# Altium schematic sheet lab2_kapustin_buck.SchDoc: =title_line_1 + title_line_2
size 594 x 420 mm
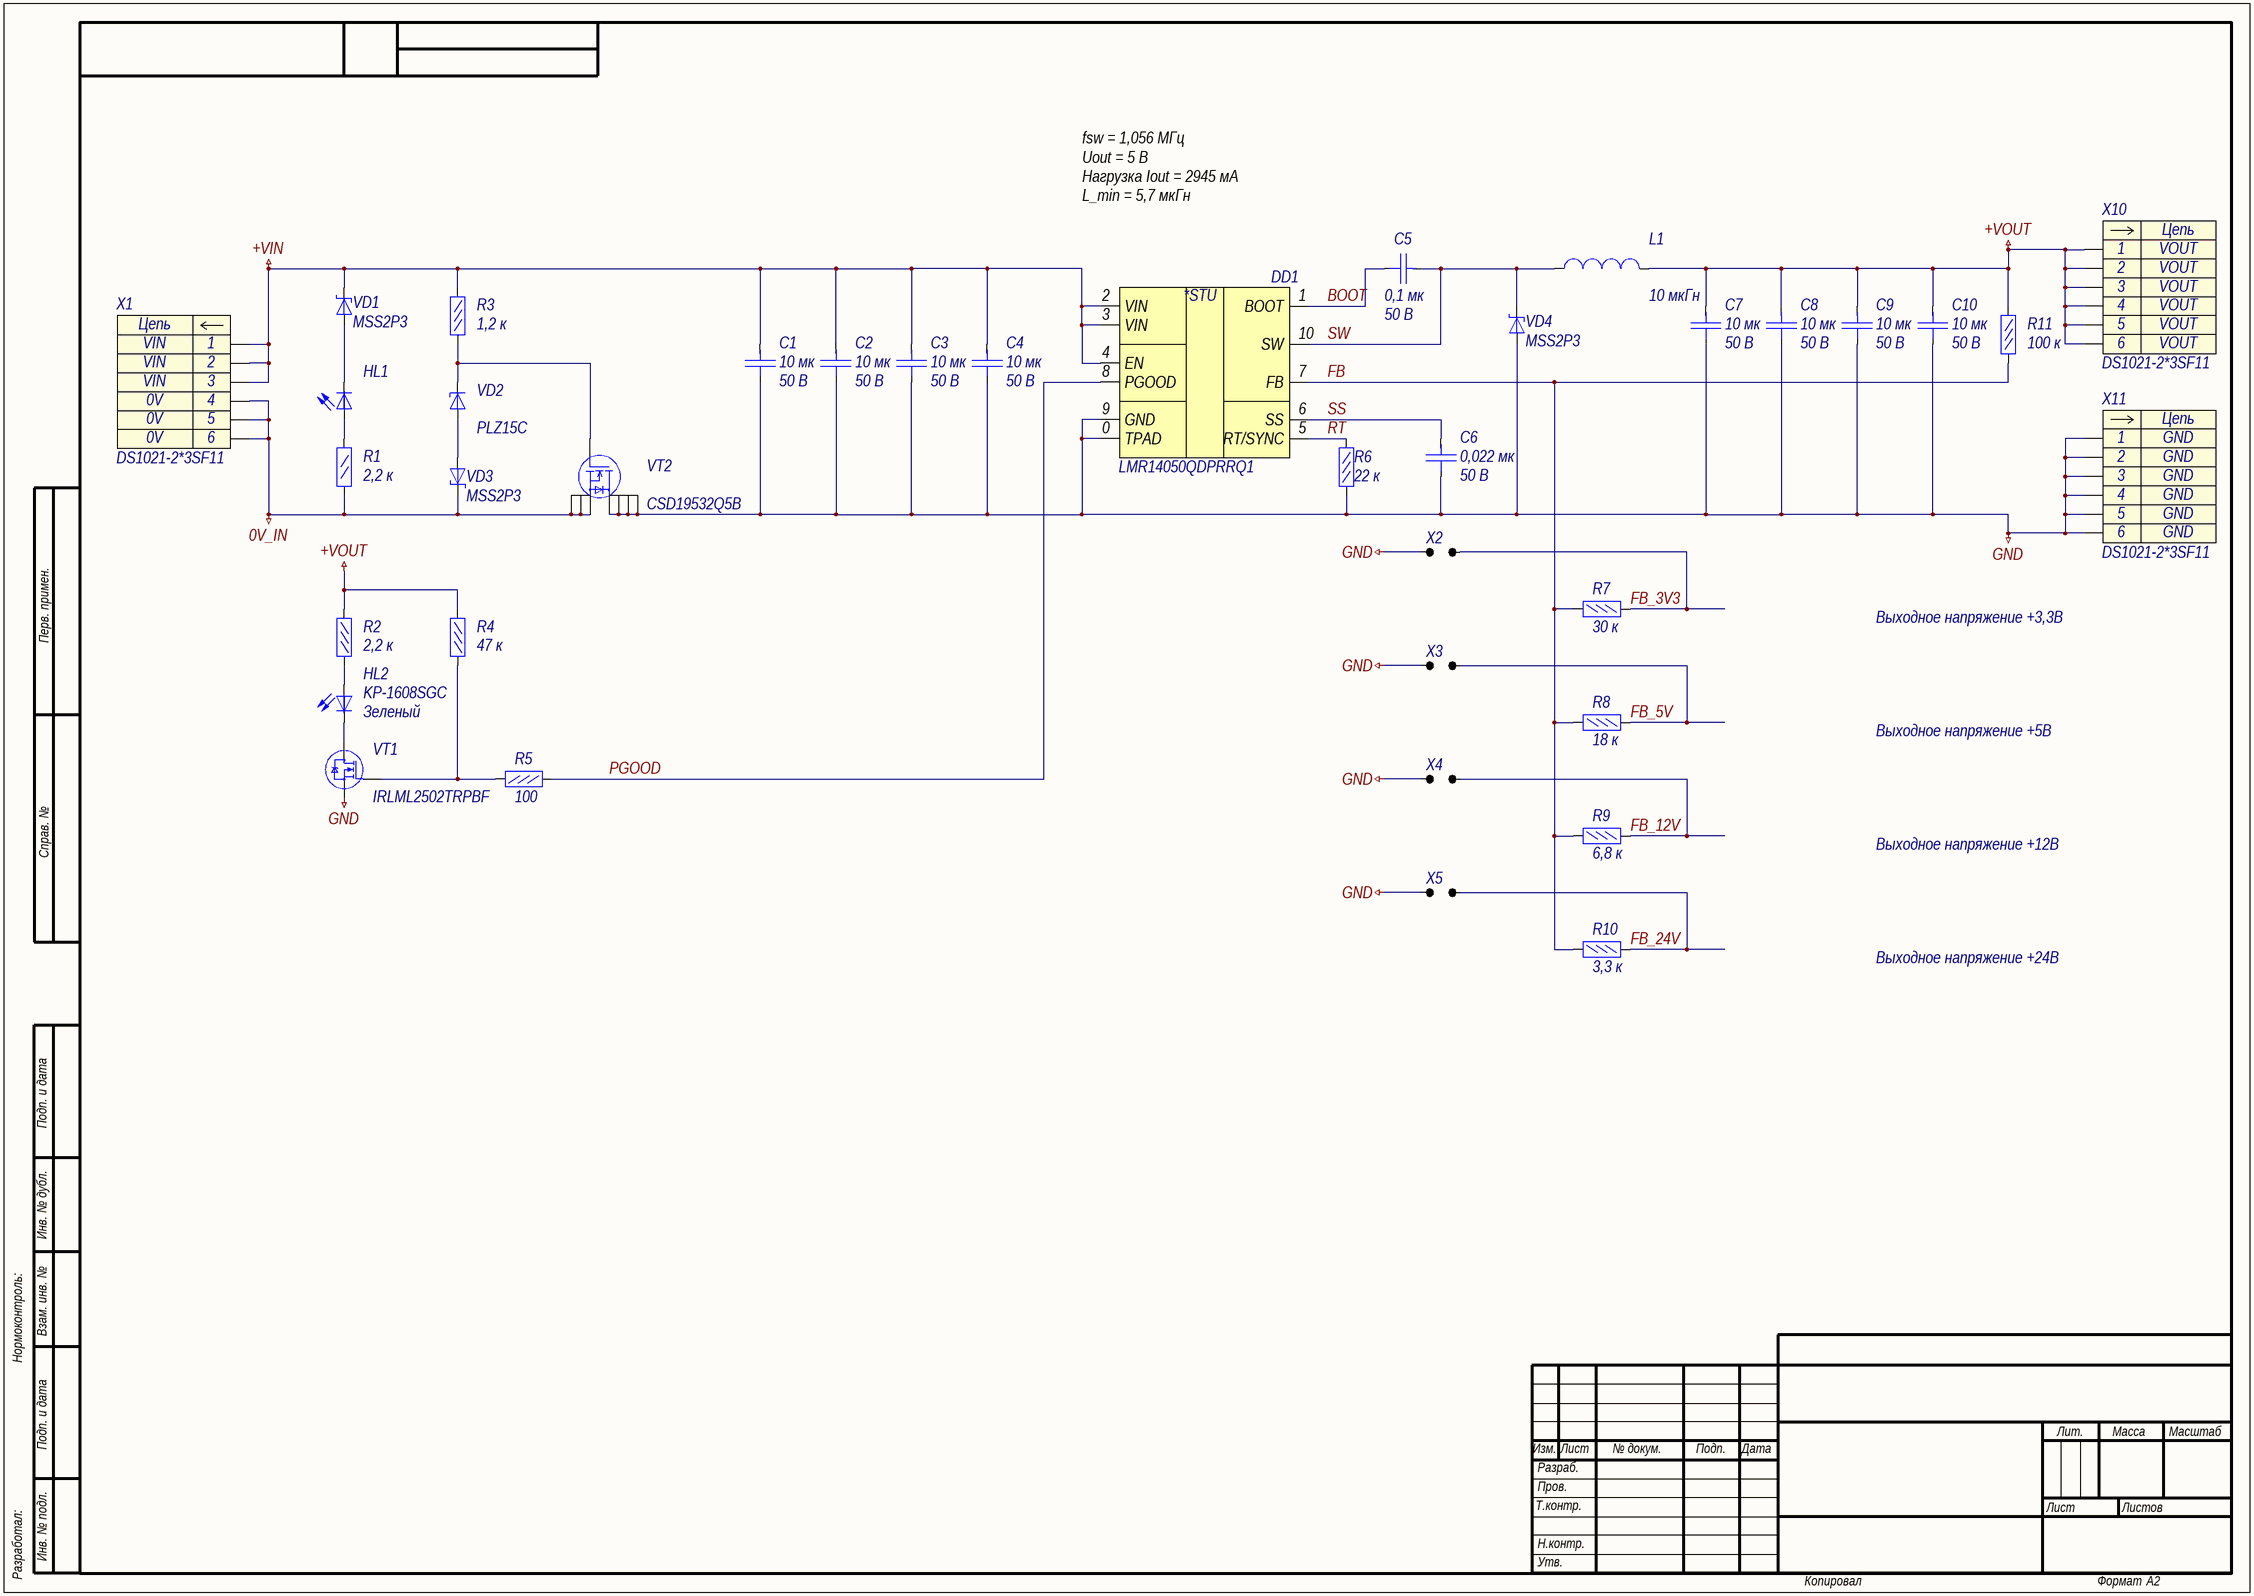
[diagram p0: lab2_kapustin_buck.SchDoc]

## Parts
C1  10 мк  Напряжение: 50 В  [C1206]
C2  10 мк  Напряжение: 50 В  [C1206]
C3  10 мк  Напряжение: 50 В  [C1206]
C4  10 мк  Напряжение: 50 В  [C1206]
C5  0,1 мк  Напряжение: 50 В  [C0603]
C6  0,022 мк  Напряжение: 50 В  [C0603]
C7  10 мк  Напряжение: 50 В  [C1206]
C8  10 мк  Напряжение: 50 В  [C1206]
C9  10 мк  Напряжение: 50 В  [C1206]
C10  10 мк  Напряжение: 50 В  [C1206]
DD1  LMR14050QDPRRQ1  [WSON-10]
HL1  KP-1608EC  [D0603]  (value not drawn)
HL2  Цвет: Зеленый  [D0603]  (hidden comment: KP-1608SGC)
L1  10 мкГн  [IHLP2525CZ]
R1  2,2 к  [R0805]
R2  2,2 к  [R0603]
R3  1,2 к  [R0603]
R4  47 к  [R0603]
R5  100  [R0603]
R6  22 к  [R0603]
R7  30 к  [R0603]
R8  18 к  [R0603]
R9  6,8 к  [R0603]
R10  3,3 к  [R0603]
R11  100 к  [R0603]
VD1  MSS2P3  [DO-219AD]
VD2  PLZ15C  [DO-219AC]
VD3  MSS2P3  [DO-219AD]
VD4  MSS2P3  [DO-219AD]
VT1  IRLML2502TRPBF  [SOT23-3]
VT2  CSD19532Q5B  [SON-8P]
X1  DS1021-2*3SF11  [PLS-2,54-2X3-THT-V]
X2  Перемычка запаиваемая 3x1  [JUMPER_SOLDERED_3X1]  (value not drawn)  (no BOM)
X3  Перемычка запаиваемая 3x1  [JUMPER_SOLDERED_3X1]  (value not drawn)  (no BOM)
X4  Перемычка запаиваемая 3x1  [JUMPER_SOLDERED_3X1]  (value not drawn)  (no BOM)
X5  Перемычка запаиваемая 3x1  [JUMPER_SOLDERED_3X1]  (value not drawn)  (no BOM)
X10  DS1021-2*3SF11  [PLS-2,54-2X3-THT-V]
X11  DS1021-2*3SF11  [PLS-2,54-2X3-THT-V]

## Nets
0V_IN: R1.1 VD3.2(K) VT2.S X1.4 X1.5 X1.6
+VIN: C1.2 C2.2 C3.2 C4.2 DD1.2(VIN) DD1.3(VIN) DD1.4(EN) R3.2 VD1.2(K) X1.1 X1.2 X1.3
+VOUT: C7.2 C8.2 C9.2 C10.2 L1.2 R2.2 R4.2 R11.2 X10.1 X10.2 X10.3 X10.4 X10.5 X10.6
GND: C1.1 C2.1 C3.1 C4.1 C6.1 C7.1 C8.1 C9.1 C10.1 DD1.0(TPAD) DD1.9(GND) R6.2 VD4.1(A) VT1.2(S) VT2.D X2.1 X3.1 X4.1 X5.1 X11.1 X11.2 X11.3 X11.4 X11.5 X11.6
BOOT: C5.1 DD1.1(BOOT)
FB: DD1.7(FB) R7.1 R8.2 R9.1 R10.1 R11.1
FB_3V3: R7.2 X2.2
FB_5V: R8.1 X3.2
FB_12V: R9.2 X4.2
FB_24V: R10.2 X5.2
PGOOD: DD1.8(PGOOD) R5.1
RT: DD1.5(RT/SYNC) R6.1
SS: C6.2 DD1.6(SS)
SW: C5.2 DD1.10(SW) L1.1 VD4.2(K)
NetHL1_1: HL1.1(A) R1.2
NetHL1_2: HL1.2(K) VD1.1(A)
NetHL2_1: HL2.1(A) R2.1
NetHL2_2: HL2.2(K) VT1.3(D)
NetR3_1: R3.1 VD2.2(K) VT2.G
NetR4_1: R4.1 R5.2 VT1.1(G)
NetVD2_1: VD2.1(A) VD3.1(A)

## Notes on the sheet
- fsw = 1,056 МГц
  Uout = 5 В
  Нагрузка Iout = 2945 мА
  L_min = 5,7 мкГн
- Выходное напряжение +3,3В
- Выходное напряжение +5В
- Выходное напряжение +12В
- Выходное напряжение +24В
- Перв. примен.
- Справ. №
- Подп. и дата
- Инв. № дубл.
- Нормоконтроль:
- Взам. инв. №
- Изм.
- Лист
- № докум.
- Подп.
- Дата
- Лит.
- Масса
- Масштаб
- Т.контр.
- Пров.
- Разраб.
- Листов
- Разработал:
- Инв. № подл.
- Н.контр.
- Утв.
- Копировал
- Формат
- А2
- (in symbol cn0076) Цепь
- (in symbol dcdc0002) *STU

## Library data of the parts
C1 C2 C7-C10 = с0042: Конденсатор; id: с0042; Фамилия: Капустин; Описание: Конденсатор керамический 1206 10 мкФ 50 В ±10 % X7R; Наименование: CL31B106KBHNNN; Производитель: Samsung; Корпус: 1206; Отклонение: ±10 %; ТКЕ: X7R; Примечание: В наименовании убрана последняя буква, обозначающая упаковку; ClassName: *; Номинал: 10 мк; HelpURL: http://weblib.samsungsem.com/mlcc/mlcc-ec-data-sheet.do?partNumber=CL31B106KBHNNN
C3 C4 = c0004: Конденсатор; id: c0004; Фамилия: Капустин; Описание: Конденсатор керамический 1206 10 мкФ 50 В ±10 % X5R; Наименование: CL31A106KBHNNNE; Производитель: Samsung; Корпус: 1206; Отклонение: ±10 %; ТКЕ: X5R; Номинал: 10 мк; HelpURL: http://www.samsungsem.com/kr/support/product-search/mlcc/__icsFiles/afieldfile/2019/05/10/19-CL31A106KBHNNNE.pdf; ClassName: POWER; Parameter 1: *
C5 = c0007: Конденсатор; id: c0007; Фамилия: Черемный; Описание: Конденсатор керамический 0603 0,1 мкФ 50 В ±10 % X7R; Наименование: CL10B104KB8NNN; Производитель: Samsung; Корпус: 0603; Отклонение: ±10 %; ТКЕ: X7R; Примечание: В наименовании убрана последняя буква, обозначающая упаковку; Номинал: 0,1 мк; HelpURL: http://www.samsungsem.com/kr/support/product-search/mlcc/__icsFiles/afieldfile/2019/06/18/CL10B104KB8NNNC-19.pdf; ClassName: POWER
C6 = c0030: Конденсатор; id: c0030; Фамилия: Капустин; Описание: Конденсатор керамический 0603 0,022 мкФ 50 В ±10 % X7R; Наименование: CL10B223KB8NNN; Производитель: Samsung; Корпус: 0603; Отклонение: ±10 %; ТКЕ: X7R; Примечание: В наименовании убрана последняя буква, обозначающая упаковку; Номинал: 0,022 мк; HelpURL: http://www.samsungsem.com/kr/support/product-search/mlcc/__icsFiles/afieldfile/2019/06/18/CL10B223KB8NNND-19.pdf; ClassName: POWER
DD1 = dcdc0002: Фамилия: Капустин; Описание: Понижающий импульсный стабилизатор; Напряжение питания ном#: 24 В; Входное напряжение мин#: 4 В; Входное напряжение макс#: 40 В; Выходное напряжение, мин#: 0,8 В; Выходное напряжение, макс#: 28 В; Выходной ток: 5 А; Частота коммутации: 0,2 … 2,5 МГц; Производитель: Texas Instruments; Температура окружающей среды (корпуса), мин#: -40 °C; Температура окружающей среды (корпуса), макс#: +125 °C; id: dcdc0002; Наименование: LMR14050QDPRRQ1; Корпус: WSON-10; HelpURL: http://www.ti.com/lit/ds/symlink/lmr14050-q1.pdf; ClassName: POWER
HL1 = led0002: Фамилия: Капустин; Описание: Светодиод красный SMD 0603; Производитель: Kingbright; Цвет: Красный; Максимальное обратное напряжение: 5 В; Прямой ток: 20 мА; Максимальное прямое напряжение: 2,5 В; Максимальный обратный ток: 10 мкА; Максимальный импульсный прямой ток: 160 мА; Температура окружающей среды (корпуса), мин#: -40 °C; Температура окружающей среды (корпуса), макс#: +85 °C; Примечание: Не найти документацию на свйте производителя; ClassName: *; id: led0002; Наименование: KP-1608EC; Корпус: D0603; HelpURL: http://www.farnell.com/datasheets/2045829.pdf?_ga=2.151514041.1066726363.1573580702-223521920.1573064505
HL2 = led0004: Фамилия: Капустин; Описание: Светодиод зеленый SMD 0603; Производитель: Kingbright; Максимальное обратное напряжение: 5 В; Прямой ток: 20 мА; Максимальное прямое напряжение: 2,5 В; Максимальный обратный ток: 11 мкА; Максимальный импульсный прямой ток: 140 мА; Температура окружающей среды (корпуса), мин#: -40 °C; Температура окружающей среды (корпуса), макс#: +85 °C; Примечание: Не найти документацию на свйте производителя; id: led0004; Наименование: KP-1608SGC; Корпус: D0603; HelpURL: http://www.farnell.com/datasheets/2045827.pdf?_ga=2.72147859.1066726363.1573580702-223521920.1573064505; ClassName: POWER
L1 = ind0005: Фамилия: Капустин; Описание: Катушка индуктивности экранированная / 10 мкГн 3 А; Наименование: IHLP2525CZER100M01; Производитель: Vishay; Отклонение: ±20%; Сопротивление обмотки: 102 мОм; Максимальный ток: 4,1 А; Ток насыщения: 7 А; Добротность: 40; Температура окружающей среды (корпуса), мин#: -55 °C; Температура окружающей среды (корпуса), макс#: +125 °C; Корпус: 6,47*6,47*3,0; id: ind0005; Номинал: 10 мкГн; HelpURL: https://www.vishay.com/docs/34104/ihlp-2525cz-01.pdf; ClassName: POWER
R1 = r0378: Резистор 0,125Вт; id: r0378; Фамилия: Капустин; Описание: Резистор чип 0805 2,2 кОм 0,125 Вт ±1 %; Наименование: RC0805FR-072K2L; Производитель: YAGEO; Отклонение: ±1 %; Напряжение: 150 В; Температурный коэффициент сопротивления: 200 ppm; Температура окружающей среды (корпуса), мин#: -55 °C; Температура окружающей среды (корпуса), макс#: +155 °C; Корпус: 0805; ClassName: *; Номинал: 2,2 к; HelpURL: https://www.yageo.com/upload/media/product/products/datasheet/rchip/PYu-RC_Group_51_RoHS_L_10.pdf
R2 = r0253: Резистор 0,063Вт; id: r0253; Фамилия: Капустин; Описание: Резистор чип 0603 2,2 кОм 0,1 Вт ±1 %; Наименование: RC0603FR-072K2L; Производитель: YAGEO; Отклонение: ±1 %; Напряжение: 75 В; Температурный коэффициент сопротивления: 200 ppm; Температура окружающей среды (корпуса), мин#: -55 °C; Температура окружающей среды (корпуса), макс#: +155 °C; Корпус: 0603; Номинал: 2,2 к; HelpURL: https://www.yageo.com/upload/media/product/products/datasheet/rchip/PYu-RC_Group_51_RoHS_L_10.pdf; ClassName: POWER
R3 = r0247: Резистор 0,063Вт; id: r0247; Фамилия: Капустин; Описание: Резистор чип 0603 1,2 кОм 0,1 Вт ±1 %; Наименование: RC0603FR-071K2L; Производитель: YAGEO; Отклонение: ±1 %; Напряжение: 75 В; Температурный коэффициент сопротивления: 200 ppm; Температура окружающей среды (корпуса), мин#: -55 °C; Температура окружающей среды (корпуса), макс#: +155 °C; Корпус: 0603; ClassName: *; Номинал: 1,2 к; HelpURL: https://www.yageo.com/upload/media/product/products/datasheet/rchip/PYu-RC_Group_51_RoHS_L_10.pdf
R4 = r0007: Резистор 0,063Вт; id: r0007; Фамилия: Капустин; Описание: Резистор чип 0603 47 кОм 0,1 Вт ±1 %; Наименование: RC0603FR-0747KL; Производитель: YAGEO; Отклонение: ±1 %; Напряжение: 75 В; Температурный коэффициент сопротивления: 200 ppm; Температура окружающей среды (корпуса), мин#: -55 °C; Температура окружающей среды (корпуса), макс#: +155 °C; Корпус: 0603; Номинал: 47 к; HelpURL: https://www.yageo.com/upload/media/product/products/datasheet/rchip/PYu-RC_Group_51_RoHS_L_10.pdf; ClassName: POWER
R5 = r0005: Резистор 0,063Вт; id: r0005; Фамилия: Капустин; Описание: Резистор чип 0603 100 Ом 0,1 Вт ±1 %; Наименование: RC0603FR-07100RL; Производитель: YAGEO; Отклонение: ±1 %; Напряжение: 75 В; Температурный коэффициент сопротивления: 200 ppm; Температура окружающей среды (корпуса), мин#: -55 °C; Температура окружающей среды (корпуса), макс#: +155 °C; Корпус: 0603; Номинал: 100; HelpURL: https://www.yageo.com/upload/media/product/products/datasheet/rchip/PYu-RC_Group_51_RoHS_L_10.pdf; ClassName: POWER
R6 = r0272: Резистор 0,063Вт; id: r0272; Фамилия: Капустин; Описание: Резистор чип 0603 22 кОм 0,1 Вт ±1 %; Наименование: RC0603FR-0722KL; Производитель: YAGEO; Отклонение: ±1 %; Напряжение: 75 В; Температурный коэффициент сопротивления: 200 ppm; Температура окружающей среды (корпуса), мин#: -55 °C; Температура окружающей среды (корпуса), макс#: +155 °C; Корпус: 0603; ClassName: POWER; Номинал: 22 к; HelpURL: https://www.yageo.com/upload/media/product/products/datasheet/rchip/PYu-RC_Group_51_RoHS_L_10.pdf
R7 = r0020: Резистор 0,063Вт; id: r0020; Фамилия: Капустин; Описание: Резистор чип 0603 30 кОм 0,1 Вт ±1 %; Наименование: RC0603FR-0730KL; Производитель: YAGEO; Отклонение: ±1 %; Напряжение: 75 В; Температурный коэффициент сопротивления: 100 ppm; Температура окружающей среды (корпуса), мин#: -55 °C; Температура окружающей среды (корпуса), макс#: +155 °C; Корпус: 0603; ClassName: *; Номинал: 30 к; HelpURL: https://www.yageo.com/upload/media/product/products/datasheet/rchip/PYu-RC_Group_51_RoHS_L_10.pdf
R8 = r0002: Резистор 0,063Вт; id: r0002; Фамилия: Капустин; Наименование: RC0603FR-0718KL; Производитель: YAGEO; Отклонение: ±1 %; Напряжение: 75 В; Корпус: 0603; Температурный коэффициент сопротивления: 200 ppm; Температура окружающей среды (корпуса), мин#: -55 °C; Температура окружающей среды (корпуса), макс#: +155 °C; Описание: Резистор чип 0603 18 кОм 0,1 Вт ±1 %; Номинал: 18 к; HelpURL: https://www.yageo.com/upload/media/product/products/datasheet/rchip/PYu-RC_Group_51_RoHS_L_10.pdf; ClassName: POWER
R9 = r0264: Резистор 0,063Вт; id: r0264; Фамилия: Капустин; Описание: Резистор чип 0603 6,8 кОм 0,1 Вт ±1 %; Наименование: RC0603FR-076K8L; Производитель: YAGEO; Отклонение: ±1 %; Напряжение: 75 В; Температурный коэффициент сопротивления: 200 ppm; Температура окружающей среды (корпуса), мин#: -55 °C; Температура окружающей среды (корпуса), макс#: +155 °C; Корпус: 0603; ClassName: *; Номинал: 6,8 к; HelpURL: https://www.yageo.com/upload/media/product/products/datasheet/rchip/PYu-RC_Group_51_RoHS_L_10.pdf
R10 = r0257: Резистор 0,063Вт; id: r0257; Фамилия: Капустин; Описание: Резистор чип 0603 3,3 кОм 0,1 Вт ±1 %; Наименование: RC0603FR-073K3L; Производитель: YAGEO; Отклонение: ±1 %; Напряжение: 75 В; Температурный коэффициент сопротивления: 200 ppm; Температура окружающей среды (корпуса), мин#: -55 °C; Температура окружающей среды (корпуса), макс#: +155 °C; Корпус: 0603; ClassName: *; Номинал: 3,3 к; HelpURL: https://www.yageo.com/upload/media/product/products/datasheet/rchip/PYu-RC_Group_51_RoHS_L_10.pdf
R11 = r0016: Резистор 0,063Вт; id: r0016; Фамилия: Капустин; Описание: Резистор чип 0603 100 кОм 0,1 Вт ±1 %; Наименование: RC0603FR-07100KL; Производитель: YAGEO; Отклонение: ±1 %; Напряжение: 75 В; Температурный коэффициент сопротивления: 200 ppm; Температура окружающей среды (корпуса), мин#: -55 °C; Температура окружающей среды (корпуса), макс#: +155 °C; Корпус: 0603; Номинал: 100 к; HelpURL: https://www.yageo.com/upload/media/product/products/datasheet/rchip/PYu-RC_Group_51_RoHS_L_10.pdf; ClassName: POWER
VD1 VD3 VD4 = vd0002: id: vd0002; Фамилия: Капустин; Описание: Диод Шоттки 30 В 2 А; Производитель: Vishay; Максимальное обратное напряжение: 30 В; Максимальный прямой ток: 2 А; Максимальное прямое напряжение: 0,6 В; Максимальный обратный ток: 250 мкА; Максимальный импульсный прямой ток: 30 А; Температура окружающей среды (корпуса), мин#: -55 °C; Температура окружающей среды (корпуса), макс#: +150 °C; ClassName: POWER; Наименование: MSS2P3; Корпус: DO-219AD; HelpURL: https://www.vishay.com/docs/89054/mss2p3.pdf
VD2 = vd0010: id: vd0010; Фамилия: Черемный; Описание: Стабилитрон 15В; Производитель: Vishay; Максимальное обратное напряжение: 15 В; Температура окружающей среды (корпуса), мин#: -40 °C; Температура окружающей среды (корпуса), макс#: 150 °C; ClassName: *; Наименование: PLZ15C; Корпус: DO-219AC; HelpURL: https://www.vishay.com/docs/84830/plzseries.pdf
VT1 = mos0001: Фамилия: Капустин; Описание: Транзистор полевой N-канальный 20 В 4,2 А; Производитель: International Rectifier; Сопротивление сток-исток: 0,045 Ом; Напряжение затвор-исток: ±12 В; Напряжение сток-исток: 20 В; Ток стока: 4,2 А; Температура окружающей среды (корпуса), мин#: -55 °C; Температура окружающей среды (корпуса), макс#: +150 °C; id: mos0001; Наименование: IRLML2502TRPBF; Корпус: SOT23-3; HelpURL: https://www.infineon.com/dgdl/irlml2502pbf.pdf?fileId=5546d462533600a401535668048e2606; ClassName: POWER
VT2 = mos0003: Фамилия: Капустин; Описание: Транзистор полевой N-канальный 100 В 17 А; Производитель: Texas Instruments; Сопротивление сток-исток: 0,0057 Ом; Напряжение затвор-исток: ±20 В; Напряжение сток-исток: 100 В; Ток стока: 17 А; Температура окружающей среды (корпуса), мин#: -55 °C; Температура окружающей среды (корпуса), макс#: +150 °C; Корпус: SON8P (5x6 мм); id: mos0003; Наименование: CSD19532Q5B; HelpURL: http://www.ti.com/lit/ds/symlink/csd19532q5b.pdf
X1 = cn0076: Contact_01: VIN; Contact_04: 0V; id: cn0076; Фамилия: Капустин; Описание: PLS 6-ти контактный прямой двухрядный (2,54 мм); Производитель: Connfly Electronic Co. LTD; Количество контактов: 6; Цвет: Черный; Ток на контакт: 3 А; Напряжение: 250 В; Шаг: 2,54 мм; Семейство: PLS; Тип вывода: Прямой; Температура окружающей среды (корпуса), мин#: -40 °C; Температура окружающей среды (корпуса), макс#: +105 °C; Альтернатива: не указана; Ответная часть: DS1023-2*3S22; Контакт: отсутствует; Contact_02: VIN; Contact_03: VIN; Contact_05: 0V; Contact_06: 0V; ClassName: *; Наименование: DS1021-2*3SF11; HelpURL: http://www.connfly.com/userfiles/image/UpLoadFile/File/2015/1/29/DS1021.pdf
X2-X5 = fstn0012: Диаметр отверстия: отсутствует; Параметры металлизации: 3x1 мм; id: fstn0012; Описание: Перемычка запаиваемая; Наименование: Перемычка запаиваемая 3x1
X10 = cn0076: Contact_01: VOUT; id: cn0076; Фамилия: Капустин; Описание: PLS 6-ти контактный прямой двухрядный (2,54 мм); Производитель: Connfly Electronic Co. LTD; Количество контактов: 6; Цвет: Черный; Ток на контакт: 3 А; Напряжение: 250 В; Шаг: 2,54 мм; Семейство: PLS; Тип вывода: Прямой; Температура окружающей среды (корпуса), мин#: -40 °C; Температура окружающей среды (корпуса), макс#: +105 °C; Альтернатива: не указана; Ответная часть: DS1023-2*3S22; Контакт: отсутствует; Contact_02: VOUT; Contact_03: VOUT; Contact_04: VOUT; Contact_05: VOUT; Contact_06: VOUT; ClassName: *; Наименование: DS1021-2*3SF11; HelpURL: http://www.connfly.com/userfiles/image/UpLoadFile/File/2015/1/29/DS1021.pdf
X11 = cn0076: Contact_01: GND; id: cn0076; Фамилия: Капустин; Описание: PLS 6-ти контактный прямой двухрядный (2,54 мм); Производитель: Connfly Electronic Co. LTD; Количество контактов: 6; Цвет: Черный; Ток на контакт: 3 А; Напряжение: 250 В; Шаг: 2,54 мм; Семейство: PLS; Тип вывода: Прямой; Температура окружающей среды (корпуса), мин#: -40 °C; Температура окружающей среды (корпуса), макс#: +105 °C; Альтернатива: не указана; Ответная часть: DS1023-2*3S22; Контакт: отсутствует; Contact_02: GND; Contact_03: GND; Contact_04: GND; Contact_05: GND; Contact_06: GND; ClassName: *; Наименование: DS1021-2*3SF11; HelpURL: http://www.connfly.com/userfiles/image/UpLoadFile/File/2015/1/29/DS1021.pdf